# Altium schematic sheet Analog Inputs 8-15.SchDoc: Ravage - Analog Inputs 8-15
size A4; Address1: Drawn By:; Address2: Dan Visser; DocumentNumber: A; Revision: 0.2
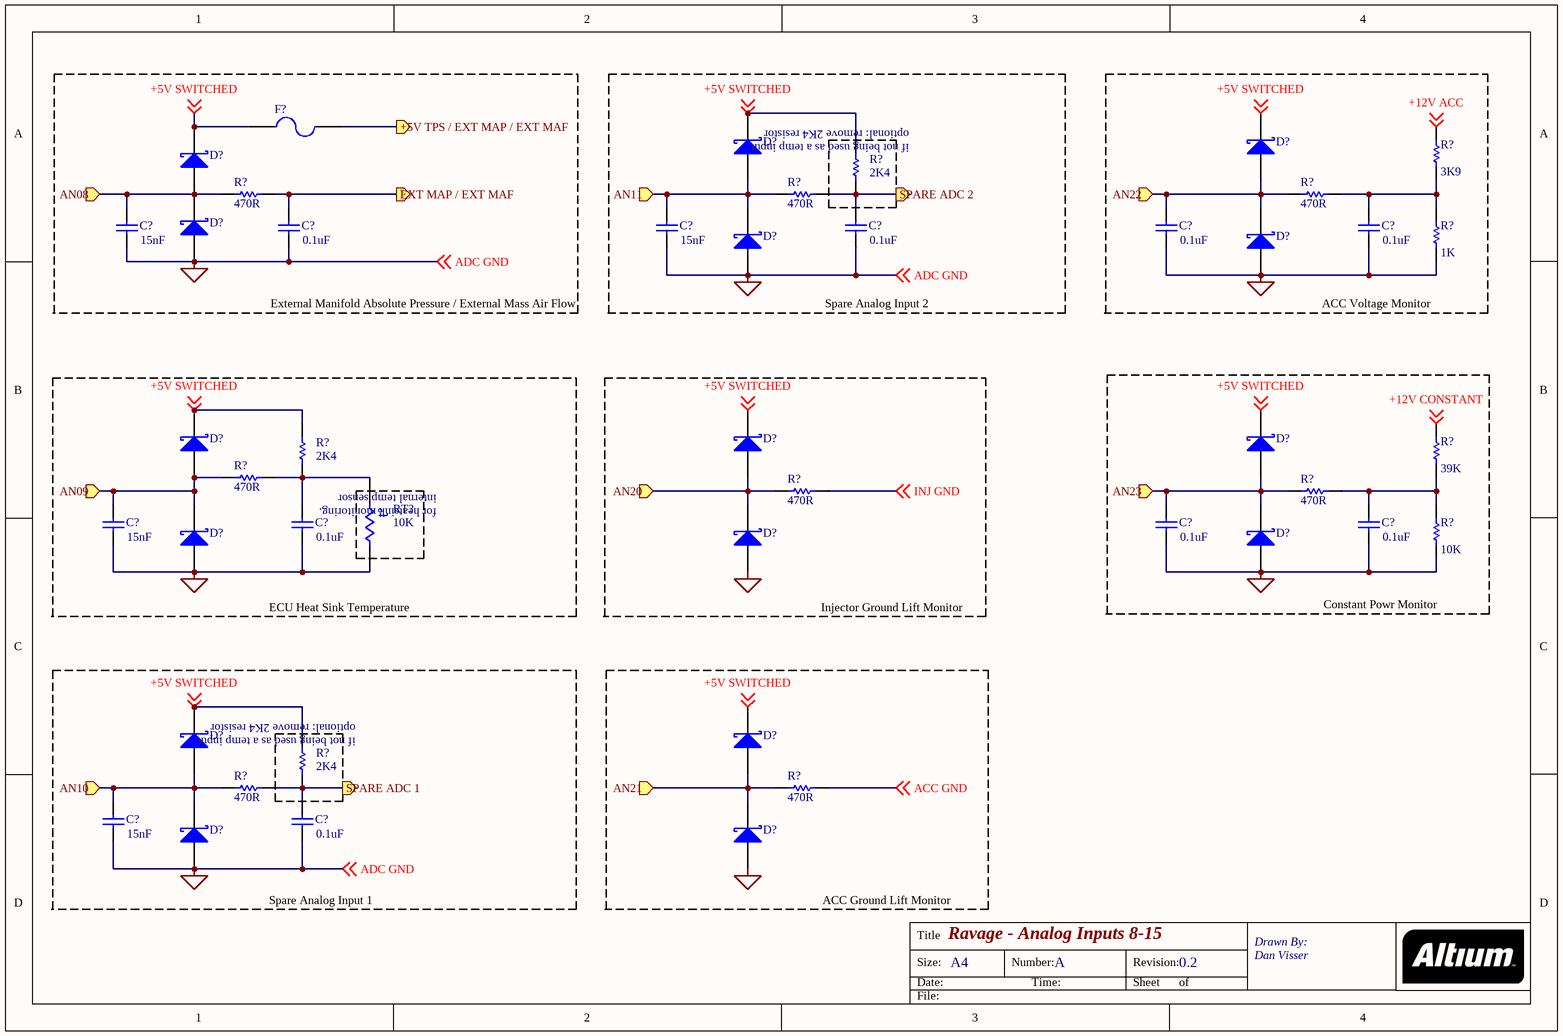
[diagram p0: Analog Inputs 8-15.SchDoc]

## Parts
(Parts that share a designator on the sheet are numbered #1, #2 ... from top to bottom, then left to right.)
C?#1  value 15nF  [RAD-0.3]
C?#2  value 0.1uF  [RAD-0.3]
C?#3  value 15nF  [RAD-0.3]
C?#4  value 0.1uF  [RAD-0.3]
C?#5  value 0.1uF  [RAD-0.3]
C?#6  value 0.1uF  [RAD-0.3]
C?#7  value 15nF  [RAD-0.3]
C?#8  value 0.1uF  [RAD-0.3]
C?#9  value 0.1uF  [RAD-0.3]
C?#10  value 0.1uF  [RAD-0.3]
C?#11  value 15nF  [RAD-0.3]
C?#12  value 0.1uF  [RAD-0.3]
D?#1  (no value)  [TO-220AC]
D?#2  (no value)  [TO-220AC]
D?#3  (no value)  [TO-220AC]
D?#4  (no value)  [TO-220AC]
D?#5  (no value)  [TO-220AC]
D?#6  (no value)  [TO-220AC]
D?#7  (no value)  [TO-220AC]
D?#8  (no value)  [TO-220AC]
D?#9  (no value)  [TO-220AC]
D?#10  (no value)  [TO-220AC]
D?#11  (no value)  [TO-220AC]
D?#12  (no value)  [TO-220AC]
D?#13  (no value)  [TO-220AC]
D?#14  (no value)  [TO-220AC]
D?#15  (no value)  [TO-220AC]
D?#16  (no value)  [TO-220AC]
F?  (no value)  [PIN-W2/E2.8]
R?#1  value 2K4  [AXIAL-0.3]
R?#2  value 3K9  [AXIAL-0.3]
R?#3  value 470R  [AXIAL-0.3]
R?#4  value 470R  [AXIAL-0.3]
R?#5  value 470R  [AXIAL-0.3]
R?#6  value 1K  [AXIAL-0.3]
R?#7  value 2K4  [AXIAL-0.3]
R?#8  value 470R  [AXIAL-0.3]
R?#9  value 39K  [AXIAL-0.3]
R?#10  value 470R  [AXIAL-0.3]
R?#11  value 470R  [AXIAL-0.3]
R?#12  value 10K  [AXIAL-0.3]
R?#13  value 2K4  [AXIAL-0.3]
R?#14  value 470R  [AXIAL-0.3]
R?#15  value 470R  [AXIAL-0.3]
RT?  10K  [6-0805_N]

## Blocks framed on the sheet
External Manifold Absolute Pressure / External Mass Air Flow: C?#1 C?#2 D?#3 D?#4 F? R?#3
ACC Voltage Monitor: C?#5 C?#6 D?#2 D?#6 R?#2 R?#5 R?#6
Injector Ground Lift Monitor: D?#8 D?#11 R?#10
Constant Powr Monitor: C?#9 C?#10 D?#9 D?#12 R?#9 R?#11 R?#12
ACC Ground Lift Monitor: D?#14 D?#16 R?#15

## Ports
+5V TPS / EXT MAP / EXT MAF (out), AN08 (in), AN09 (in), AN10 (in), AN11 (in), AN20 (in), AN21 (in), AN22 (in), AN23 (in), EXT MAP / EXT MAF (out), SPARE ADC 1 (out), SPARE ADC 2 (out)

## Nets
ADC GND: C?#1.1 C?#2.1 C?#3.1 C?#4.1 C?#5.1 C?#6.1 C?#7.1 C?#8.1 C?#9.1 C?#10.1 C?#11.1 C?#12.1 D?#4.3(A) D?#5.3(A) D?#6.3(A) D?#10.3(A) D?#11.3(A) D?#12.3(A) D?#15.3(A) D?#16.3(A) R?#6.1 R?#12.1 RT?.2 ; off-sheet ADC GND
+5V SWITCHED: D?#1.1(K) D?#2.1(K) D?#3.1(K) D?#7.1(K) D?#8.1(K) D?#9.1(K) D?#13.1(K) D?#14.1(K) F?.1 R?#1.1 R?#7.1 R?#13.1 ; off-sheet +5V SWITCHED
+5V TPS / EXT MAP / EXT MAF: F?.2 ; port +5V TPS / EXT MAP / EXT MAF
+12V ACC: R?#2.2 ; off-sheet +12V ACC
+12V CONSTANT: R?#9.2 ; off-sheet +12V CONSTANT
ACC GND: R?#15.2 ; off-sheet ACC GND
AN08: C?#1.2 D?#3.3(A) D?#4.1(K) R?#3.1 ; port AN08
AN09: C?#7.2 D?#7.3(A) D?#10.1(K) R?#8.1 ; port AN09
AN10: C?#11.2 D?#13.3(A) D?#15.1(K) R?#14.1 ; port AN10
AN11: C?#3.2 D?#1.3(A) D?#5.1(K) R?#4.1 ; port AN11
AN20: D?#8.3(A) D?#11.1(K) R?#10.1 ; port AN20
AN21: D?#14.3(A) D?#16.1(K) R?#15.1 ; port AN21
AN22: C?#5.2 D?#2.3(A) D?#6.1(K) R?#5.1 ; port AN22
AN23: C?#9.2 D?#9.3(A) D?#12.1(K) R?#11.1 ; port AN23
EXT MAP / EXT MAF: C?#2.2 R?#3.2 ; port EXT MAP / EXT MAF
INJ GND: R?#10.2 ; off-sheet INJ GND
SPARE ADC 1: C?#12.2 R?#13.2 R?#14.2 ; port SPARE ADC 1
SPARE ADC 2: C?#4.2 R?#1.2 R?#4.2 ; port SPARE ADC 2
NetC?#6_2: C?#6.2 R?#2.1 R?#5.2 R?#6.2
NetC?#8_2: C?#8.2 R?#7.2 R?#8.2 RT?.1
NetC?#10_2: C?#10.2 R?#9.1 R?#11.2 R?#12.2

## Notes on the sheet
- optional: remove 2K4 resistor
- if not being used as a temp input.
- Spare Analog Input 2
- internal temp sensor
- for heatsink monitoring.
- ECU Heat Sink Temperature
- Spare Analog Input 1
- Title
- Size:
- Date:
- A4
- Number:
- Time:
- Revision:
- Sheet
- of
- File:
- (in symbol Res Thermal) t°

## Library data of the parts
C?#1-C?#12 = Cap: Capacitor; Published: 8-Jun-2000; LatestRevisionDate: 17-Jul-2002; LatestRevisionNote: Re-released for DXP Platform.; PackageReference: RAD-0.3; Publisher: Altium Limited; PackageDescription: Radial Cap, Thru-Hole; 2 Leads; 0.3 in Pin Spacing
D?#1-D?#16 = Diode 18TQ045: Schottky Rectifier; Note: Terminal 2 is the TAB and is electrically connected to the cathode; Published: 8-Jun-2000; LatestRevisionDate: 17-Jul-2002; LatestRevisionNote: Re-released for DXP Platform.; DatasheetVersion: Dec-1997; PackageVersion: Feb-1998; PackageReference: TO-220AC; Publisher: Altium Limited; PackageDescription: TO, Thru-Hole, Vertical, Heatsink Mounted; 3 In-Line Leads (1 Absent); Pitch 2.54 mm; ComponentLink1Description: Manufacturer Link; ComponentLink1URL: http://www.irf.com/; ComponentLink2Description: Datasheet; ComponentLink2URL: http://www.irf.com/product-info/datasheets/data/18tq.pdf
F? = Fuse 2: Fuse; Published: 8-Jun-2000; LatestRevisionDate: 17-Jul-2002; LatestRevisionNote: Re-released for DXP Platform.; PackageReference: PIN-W2/E2.8; Publisher: Altium Limited; PackageDescription: Thru-Hole; 2 Leads
R?#1-R?#15 = Res1: Resistor; Published: 8-Jun-2000; LatestRevisionDate: 17-Jul-2002; LatestRevisionNote: Re-released for DXP Platform.; PackageReference: AXIAL-0.3; Publisher: Altium Limited; PackageDescription: Axial Device, Thru-Hole; 2 Leads; 0.3 in Pin Spacing
RT? = Res Thermal: Thermistor; Published: 24-Mar-1999; LatestRevisionDate: 29-May-2009; LatestRevisionNote: IPC-7351 Footprint Added.; PackageVersion: Mar-2003; PackageReference: 6-0805; Publisher: Altium Limited; PackageDescription: Chip Resistor 0805 Case Size; Code_IPC: RESC2012